# EasyEDA Pro project ProPrj_WatcheRobot2.0openSource_2026-06-17.epro, board 反馈舵机STM32控制板PCB
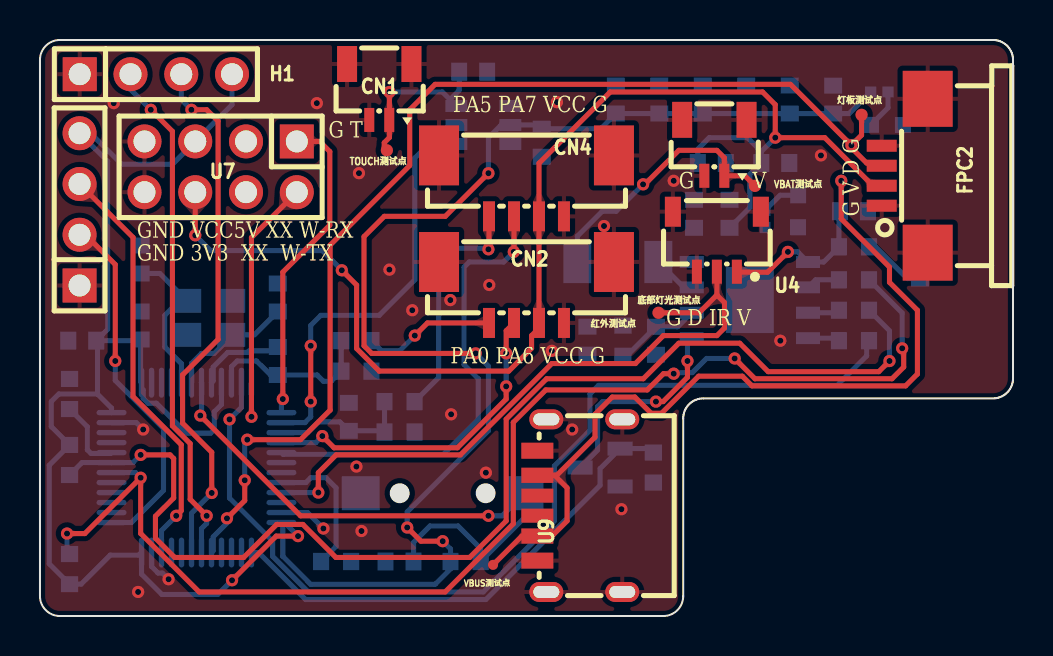
[diagram p10: board, top side]
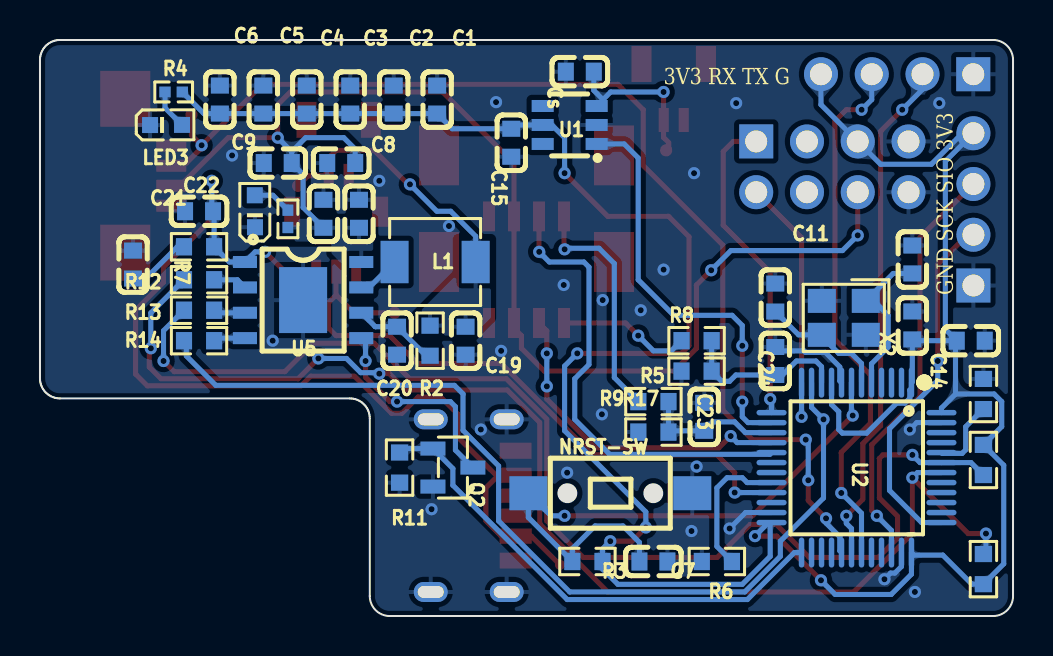
[diagram p11: board, bottom side, seen from below]

Outline 48.68 x 28.83 mm; copper layers: Top Layer, Bottom Layer. Coordinates in mm from the lower left corner of the outline.
Outline path: 0,27.83 0,1 arc(0.29,0.29) 1,0 31.18,0 arc(31.89,0.29) 32.18,1 32.18,9.89 32.19,9.98 32.2,10.07 32.22,10.16 32.25,10.25 32.29,10.34 32.33,10.42 32.39,10.49 32.44,10.56 32.51,10.63 32.58,10.69 32.66,10.74 32.74,10.78 32.82,10.82 32.91,10.85 33,10.87 33.09,10.89 33.18,10.89 47.68,10.89 47.78,10.89 47.87,10.91 47.96,10.93 48.04,10.96 48.13,10.99 48.21,11.04 48.29,11.09 48.36,11.15 48.42,11.22 48.48,11.29 48.53,11.36 48.58,11.44 48.62,11.53 48.64,11.62 48.67,11.71 48.68,11.8 48.68,11.89 48.68,27.83 48.68,27.92 48.67,28.01 48.64,28.1 48.62,28.19 48.58,28.27 48.53,28.35 48.48,28.43 48.42,28.5 48.36,28.57 48.29,28.62 48.21,28.68 48.13,28.72 48.04,28.76 47.96,28.79 47.87,28.81 47.78,28.82 47.68,28.83 1,28.83 arc(0.29,28.53) 0,27.83
Stack: Top Layer 0.035mm / Dielectric1 1.51mm FR4 er 4.5 / Bottom Layer 0.035mm

## Design rules (mm)
spacing copperThickness1oz (default): track to track 0.102, other pairs 0.152 to 0.3
spacing copperThickness2oz: track to track 0.203, other pairs 0.152 to 0.3
track width copperThickness1oz (default): min 0.127, default 0.254, max 2.54
track width copperThickness2oz: min 0.203, default 0.254, max 2.54
differential pair differentialPair (default): width min 0.127, default 0.254, max 2.54; gap min 0.152, default 0.152
net GND uses copperRegion

## Placement (name value [footprint] x y rotation side)
C1  100nF  [C0603]  28.81 25.84 270 bottom
C2  100nF  [C0603]  30.99 25.84 270 bottom
C3  100nF  [C0603]  33.16 25.84 270 bottom
C4  100nF  [C0603]  35.33 25.84 270 bottom
C5  100nF  [C0603]  37.51 25.84 270 bottom
C6  4.7uf  [C0603]  39.68 25.84 270 bottom
C7  100nF  [C0603]  17.99 2.73 180 bottom
C8  22uF  [C0603]  33.61 22.67 180 bottom
C9  22uF  [C0603]  36.79 22.67 180 bottom
C10  20pF  [C0603]  5.04 17.84 270 bottom
C11  20pF  [C0603]  11.9 15.94 270 bottom
C13  100nF  [C0603]  5.04 14.54 270 bottom
C14  100nF  [C0603]  2.12 13.78 0 bottom
C15  100nF  [C0603]  25.1 23.68 90 bottom
C17  22uF  [C0603]  32.72 20.13 270 bottom
C18  22uF  [C0603]  34.5 20.13 270 bottom
C19  22uF  [C0603]  27.39 13.78 90 bottom
C20  22uF  [C0603]  30.82 13.78 90 bottom
C21  10uF  [C0603]  44.03 17.59 270 bottom
C22  10uF  [C0603]  40.72 20.26 180 bottom
C23  100nF  [C0603]  15.45 9.97 270 bottom
C24  100nF  [C0603]  11.9 12.76 270 bottom
CN1  SH1.0mm立式  [CONN-SMD_2P-P1.00_HC-1.0-2PLT]  16.98 26.22 180 top
CN2  SH-MX1.25-4PLT  [CONN-SMD_4P-P1.25_SH-MX1.25-4PLT]  24.34 16.19 180 top
CN3  SH1.0mm立式  [CONN-SMD_2P-P1.00_HC-1.0-2PLT]  33.74 23.43 180 top
CN4  SH-MX1.25-4PLT  [CONN-SMD_4P-P1.25_SH-MX1.25-4PLT]  24.34 21.53 180 top
Cs  50pF  [C0603]  21.67 27.24 180 bottom
FPC2  FPC4_1mm(下接)  [FPC-SMD_4P-P1.00_C9900022405]  43.26 22.03 90 top
H1  PZ254V-11-04P  [HDR-TH_4P-P2.54-V-M]  5.8 27.11 0 top
H3  PZ254V-11-04P  [HDR-TH_4P-P2.54-V-M]  1.98 20.35 90 top
L1  1uH  [IND-SMD_L4.4-W4.2]  28.91 17.72 0 bottom
LED1  XL-1608UGC-04  [LED0603-RD_GREEN]  37.93 20.26 90 bottom
LED3  XL-1608UGC-04  [LED0603-RD_GREEN]  42.38 24.57 180 bottom
NOREF  -  [Pad_e447]  35.77 21.53 0 top
NOREF#2  -  [Pad_e448]  41.11 25.08 0 top
NOREF#3  -  [Pad_e446]  30.95 15.18 0 top
NOREF#4  -  [Pad_e445]  17.36 23.3 0 top
NRST-SW  1TS002C-2300-4300-CT  [SW-SMD_L6.0-W3.5-LS8.0-EH]  20.15 6.15 180 bottom
Q2  2N7002  [SOT-23-3_L2.9-W1.3-P1.90-LS2.4-BR]  28.02 7.43 0 bottom
R1  10K  [R0603]  1.48 11.11 270 bottom
R2  0Ω  [R0603]  29.17 13.78 90 bottom
R3  10K  [R0603]  21.29 2.73 0 bottom
R4  1kΩ  [R0402]  41.99 26.22 180 bottom
R5  18K  [R0603]  15.83 12.25 180 bottom
R6  10K  [R0603]  14.82 2.73 180 bottom
R7  2Ω  [R0603]  40.72 18.48 180 bottom
R8  10K  [R0603]  15.83 13.78 180 bottom
R9  10K  [R0603]  17.99 10.73 180 bottom
R10  10K  [R0603]  1.48 7.81 90 bottom
R11  100K  [R0603]  30.69 7.43 90 bottom
R12  0Ω  [R0603]  40.72 16.83 0 bottom
R13  0Ω  [R0603]  40.72 15.3 0 bottom
R14  0Ω  [R0603]  40.72 13.78 0 bottom
R15  1kΩ  [R0402]  36.28 19.87 270 bottom
R16  10K  [R0603]  1.48 2.35 270 bottom
R17  18K  [R0603]  17.99 9.21 0 bottom
U1  TTP223E-BA6  [SOT-23-6_L2.9-W1.6-P0.95-LS2.8-BR]  22.18 24.57 180 bottom
U2  STM32F103CBT6  [LQFP-48_L7.0-W7.0-P0.50-LS9.0-BL]  7.83 7.43 0 bottom
U4  ZX-SH1.0-3PLT  [CONN-SMD_3P-P1.00_HDGC_HDGC1002WV-S-3P]  33.87 18.73 180 top
U5  IP5306  [ESOP-8_L4.9-W3.9-P1.27-LS6.0-BL-EP]  35.52 15.81 270 bottom
U7  PZ2.54-2*4  [HDR-TH_8P-P2.54-V-M-R2-C4-S2.54]  9.04 22.48 180 top
U9  YTC-TC6-268  [TYPE-C-SMD_YIYUAN_YTC-TC6-268]  27.01 5.52 90 top
VBUS测试点  -  [Test-Point-0.5mm]  22.67 2.56 0 top
X2  8MHz  [CRYSTAL-SMD_4P-L3.2-W2.5-BL]  8.47 14.92 0 bottom

## Footprints (pads in the part's own frame, mm; a bottom-side part is the same pattern mirrored in y, then rotated)
C0603
  rect 0.8x0.9 smd: 1(-0.7,0) 2(0.7,0)
CONN-SMD_2P-P1.00_HC-1.0-2PLT
  rect 0.5x1.2 smd: 1(-0.5,1.4) 2(0.5,1.4)
  rect 1x1.8 smd: 3(1.61,-1.4) 4(-1.61,-1.4)
CONN-SMD_3P-P1.00_HDGC_HDGC1002WV-S-3P
  rect 0.5x1.2 smd: 1(-1,1.5) 2(0,1.5) 3(1,1.5)
  rect 0.8x1.5 smd: 4(2.2,-1.5) 5(-2.2,-1.5)
CONN-SMD_4P-P1.25_SH-MX1.25-4PLT
  rect 0.6x1.5 smd: 1(-1.875,1.525) 2(-0.625,1.525) 3(0.625,1.525) 4(1.875,1.525)
  rect 2x3 smd: 5(4.375,-1.525) 6(-4.375,-1.525)
CRYSTAL-SMD_4P-L3.2-W2.5-BL
  rect 1.4x1.2 smd: 1(-1.1,-0.85) 2(1.1,-0.85) 3(1.1,0.85) 4(-1.1,0.85)
ESOP-8_L4.9-W3.9-P1.27-LS6.0-BL-EP
  rect 0.6x1.2 smd: 1(-1.905,-2.909) 2(-0.635,-2.909) 3(0.635,-2.909) 4(1.905,-2.909) 5(1.905,2.909) 6(0.635,2.909) 7(-0.635,2.909) 8(-1.905,2.909)
  rect 3.3x2.4 smd: 9(0,0)
FPC-SMD_4P-P1.00_C9900022405
  rect 0.6x1.5 smd: 1(-1.5,1.15) 2(-0.5,1.15) 3(0.5,1.15) 4(1.5,1.15)
  rect 2.8x2.5 smd: 5(3.85,-1.15) 6(-3.85,-1.15)
HDR-TH_4P-P2.54-V-M
  rect 1.7x1.7 hole 1.1: 1(-3.81,0)
  round 1.7 hole 1.1: 2(-1.27,0) 3(1.27,0) 4(3.81,0)
HDR-TH_8P-P2.54-V-M-R2-C4-S2.54
  rect 1.7x1.7 hole 1.1: 1(-3.81,-1.27)
  round 1.7 hole 1.1: 2(-3.81,1.27) 3(-1.27,-1.27) 4(-1.27,1.27) 5(1.27,-1.27) 6(1.27,1.27) 7(3.81,-1.27) 8(3.81,1.27)
IND-SMD_L4.4-W4.2
  rect 1.4x2.12 smd: 1(2.028,0) 2(-2.028,0)
LED0603-RD_GREEN
  rect 0.8x0.8 smd: 1(-0.799,-0.004) 2(0.799,0.004)
LQFP-48_L7.0-W7.0-P0.50-LS9.0-BL
  oval 0.27x1.5 smd: 1(-2.75,-4.25) 2(-2.25,-4.25) 3(-1.75,-4.25) 4(-1.25,-4.25) 5(-0.75,-4.25) 6(-0.25,-4.25) 7(0.25,-4.25) 8(0.75,-4.25) 9(1.25,-4.25) 10(1.75,-4.25) 11(2.25,-4.25) 12(2.75,-4.25) 25(2.75,4.25) 26(2.25,4.25) 27(1.75,4.25) 28(1.25,4.25) 29(0.75,4.25) 30(0.25,4.25) 31(-0.25,4.25) 32(-0.75,4.25) 33(-1.25,4.25) 34(-1.75,4.25) 35(-2.25,4.25) 36(-2.75,4.25)
  oval 1.5x0.27 smd: 13(4.25,-2.75) 14(4.25,-2.25) 15(4.25,-1.75) 16(4.25,-1.25) 17(4.25,-0.75) 18(4.25,-0.25) 19(4.25,0.25) 20(4.25,0.75) 21(4.25,1.25) 22(4.25,1.75) 23(4.25,2.25) 24(4.25,2.75) 37(-4.25,2.75) 38(-4.25,2.25) 39(-4.25,1.75) 40(-4.25,1.25) 41(-4.25,0.75) 42(-4.25,0.25) 43(-4.25,-0.25) 44(-4.25,-0.75) 45(-4.25,-1.25) 46(-4.25,-1.75) 47(-4.25,-2.25) 48(-4.25,-2.75)
Pad_e445
  round 0.61 smd: TP1(0,0)
Pad_e446
  round 0.61 smd: TP3(0,0)
Pad_e447
  round 0.61 smd: TP2(0,0)
Pad_e448
  round 0.61 smd: TP5(0,0)
R0402
  rect 0.566x0.54 smd: 1(-0.433,0) 2(0.433,0)
R0603
  rect 0.806x0.864 smd: 1(-0.753,0) 2(0.753,0)
SOT-23-3_L2.9-W1.3-P1.90-LS2.4-BR
  rect 1.25x0.7 smd: 1(1,-0.95) 2(1,0.95) 3(-1,0)
SOT-23-6_L2.9-W1.6-P0.95-LS2.8-BR
  rect 1.1x0.6 smd: 1(1.35,-0.95) 2(1.35,0) 3(1.35,0.95) 4(-1.35,0.95) 5(-1.35,0) 6(-1.35,-0.95)
SW-SMD_L6.0-W3.5-LS8.0-EH
  rect 1.9x1.7 smd: 1(-4.1,0) 2(4.1,0)
Test-Point-0.5mm
  round 0.5 smd: 1(0,0)
TYPE-C-SMD_YIYUAN_YTC-TC6-268
  oval 1x1.7 hole 0.6x1.3: 1(-4.32,1.675) 2(4.32,1.675) 3(4.32,-2.124) 4(-4.32,-2.124)
  rect 0.7x1.6 smd: A5(-0.5,2.124) B5(0.5,2.124)
  rect 0.76x1.6 smd: A9(1.52,2.124) B9(-1.52,2.124)
  rect 0.8x1.6 smd: A12(2.75,2.124) B12(-2.75,2.124)

## Nets
As in the schematic, except:
VBAT: C19.2 CN3.1 L1.2 NOREF.TP2 R2.2
LED_DI: FPC2.3 NOREF#2.TP5 U2.29
WS2812_BOTTOM_DIN: NOREF#3.TP3 U2.21 U4.2
$1N85: CN1.1 Cs.2 NOREF#4.TP1 U1.3

Pads without a net: U1 4 6; U2 2 3 4 18 19 22 26 27 28 32 33 38 39 40 41 45 46; U9 A5 B5

## Via types
v1: diameter 0.61, hole 0.305, Top Layer to Bottom Layer, 69 vias

## Routing (per net, layer and track width the routed paths; a pad name or vN(x,y) marks a point on that pad's centre or on a via; arc(x,y) is an arc through that point)
GND: length 10.5
  Bottom Layer w0.254: NRST-SW.2 16.09,6.11 ; C24.1 11.7,13.27 10.46,13.27 10.38,13.19 9.39,13.19 8.67,12.46 8.67,11.76 U2.8 ; U2.23 13.38,5.18 v1(14.18,4.38) ; v1(5.16,9.33) 4.82,9.68 U2.47 ; U2.35 5.58,2.48 5.91,2.15 6.13,2.15 v1(6.43,1.84)
  vias: v1(3.69,25.67) v1(4.91,1.21) v1(13.85,25.67) v1(15.83,7.48) v1(15.96,22.16) v1(16.09,4.25) v1(17.48,17.33) v1(18.63,15.3) v1(20.53,15.81) v1(20.57,10.1) v1(22.31,7.17) v1(22.48,16.57) v1(25.61,13.27) v1(25.87,25.72) v1(26.63,9.33) v1(28.22,19.52) v1(29.09,5.35) v1(31.71,21.78) v1(37.04,13.78) v1(39.07,23.05)
VBAT: length 13.2
  Top Layer w0.254: NOREF.TP2 35.27,22.03 CN3.1 34.24,22.93 33.87,23.3 31.96,23.3 30.26,21.6 v1(30.17,21.6)
  Bottom Layer w0.254: L1.2 26.89,19.01 28.13,20.26 28.83,20.26 v1(30.17,21.6)
VBUS: length 50.8
  Top Layer w0.254: 25.74,7.04 25.86,7.04 27.77,8.95 27.77,10.1 28.63,10.96 29.76,10.96 30.58,10.15 31.1,10.15 32.95,12 35.14,12 35.62,11.52 43.31,11.52 43.9,12.11 43.9,15.3 42.5,16.7 42.5,17.46 40.09,19.87 v1(40.09,21.78) ; 25.74,7.04 26.37,6.41 26.37,4.76 25.62,4 U9.B9 24.11,4 VBUS测试点.1 ; 25.74,7.04 U9.A9 ; v1(37.42,18.22) 36.41,17.21 34.89,17.21 34.76,17.08
  Bottom Layer w0.254: v1(37.42,18.22) 37.92,18.22 U5.1 39.21,17.72 R7.2 39.97,20.2 C22.2 40.09,20.32 v1(40.09,21.78)
VCC_5V: length 64.9
  Top Layer w0.254: U7.6 v1(7.77,19.05) ; v1(15.1,17.3) 15.84,16.56 15.84,13.39 16.97,12.26 23.45,12.26 24.6,13.4 24.6,14.03 24.97,14.4 CN2.2 24.97,22.66 28.53,26.22 36.15,26.22 36.79,25.59 v1(36.79,23.94) 39.27,23.94 41.67,21.53 FPC2.2
  Bottom Layer w0.254: v1(36.79,23.94) 36.09,23.24 ; 36.09,23.24 C9.2 35.52,22.1 35.52,20.44 C18.2 ; 36.09,23.24 36.09,23.24 35.39,23.94 33.49,23.94 32.91,23.37 C8.2 ; v1(7.77,19.05) 8.53,18.29 14.12,18.29 v1(15.1,17.3)
BOOT0: length 3.7
  Bottom Layer w0.254: U2.44 3.54,8.14 2.55,8.14 2.37,8.32 2.37,9.47 R1.2
LED_DI: length 55.5
  Top Layer w0.254: v1(10.37,8.83) 13.04,8.83 14.52,10.3 14.52,18.56 18.5,22.54 18.5,25.34 19.77,26.61 37.55,26.61 v1(40.6,23.56) ; v1(10.24,6.79) 10.24,5.78 v1(9.36,4.89) ; FPC2.3 41.98,22.67 41.36,22.67 40.6,23.43 v1(40.6,23.56) ; v1(40.6,23.56) 41.11,24.07 NOREF#2.TP5
  Bottom Layer w0.254: v1(10.24,6.79) 10.24,8.7 v1(10.37,8.83) ; U2.29 8.67,3.26 8.67,3.96 9.36,4.65 v1(9.36,4.89)
NRST: length 30.5
  Top Layer w0.254: v1(22.44,5.02) 13.04,5.02 v1(8.02,10.03)
  Bottom Layer w0.254: v1(8.02,10.03) 8.09,10.1 8.09,11.67 U2.7 ; v1(22.44,5.02) 23.12,5.02 NRST-SW.1 24.25,4.93 R3.2 22.05,3.37 20.91,4.51 19.52,4.51 18.69,3.68 C7.1
OSC_IN: length 8
  Bottom Layer w0.254: U2.5 7.08,12.62 6.24,13.46 6.24,15.05 6.97,15.77 X2.1 6,17.14 C10.2
OSC_OUT: length 6.4
  Bottom Layer w0.254: U2.6 7.58,12.64 8.09,13.14 8.72,13.14 9.57,13.99 X2.3 10.73,14.07 C11.2
PA0/SERVO1FB: length 6.7
  Top Layer w0.254: CN2.4 19.39,14.67 v1(18.75,14.03)
  Bottom Layer w0.254: v1(18.75,14.03) 17.99,13.27 17.09,13.27 R8.1
PA1_IP5306_IRQ: length 48.7
  Bottom Layer w0.254: R14.2 41.36,13.66 41.36,13.02 39.89,11.54 27.95,11.54 27.52,11.11 27.52,9.29 25.74,7.51 25.74,4.76 22.18,1.21 13.42,1.21 11.64,2.99 11.64,3.75 9.48,5.9 v1(9.48,9.84) 10.08,10.44 U2.11
PA5/SERVO2FB: length 11.9
  Top Layer w0.254: v1(22.44,18.35) 22.47,18.38 22.47,20
  Bottom Layer w0.254: R9.1 19.95,11.93 19.95,17.64 20.71,18.4 22.38,18.4 v1(22.44,18.35)
PA6TIME3: length 16.6
  Top Layer w0.254: v1(23.33,11.49) 23.33,10.86 20.89,8.42 14.71,8.42 v1(14.13,9.01) ; v1(23.33,13.14) 23.33,14.28 CN2.3
  Bottom Layer w0.254: U2.16 13.8,8.68 v1(14.13,9.01) ; v1(23.33,11.49) v1(23.33,13.14)
PA7TIME3: length 23.1
  Top Layer w0.254: 23.72,20 23.72,18.23 v1(23.71,18.22)
  Bottom Layer w0.254: U2.17 12.17,8.09 20.18,8.09 21.93,9.84 21.93,11.87 21.22,12.58 21.22,17.46 21.47,17.72 23.2,17.72 v1(23.71,18.22)
PA9/USART1_TX: length 25.6
  Top Layer w0.254: v1(8.34,5.02) 7.52,5.84 7.52,8.63 6.63,9.52 6.63,24.25 v1(5.55,25.34)
  Bottom Layer w0.254: U2.30 8.08,4.38 8.34,4.63 v1(8.34,5.02) ; H1.2 4.53,26.35 v1(5.55,25.34)
PA10/USART1_RX: length 26.9
  Top Layer w0.254: v1(8.59,6.16) 8.59,8.19 7.13,9.65 7.13,12.07 8.91,13.84 8.91,24.77 8.34,25.34 v1(7.58,25.34)
  Bottom Layer w0.254: v1(7.58,25.34) 7.07,25.84 H1.3 ; U2.31 7.58,5.15 v1(8.59,6.16)
PA13/SWDIO: length 21
  Top Layer w0.254: H3.3 4.66,18.95 4.66,10.98 7.07,8.57 7.07,5.27 v1(6.82,5.02)
  Bottom Layer w0.254: U2.34 6.08,4.28 v1(6.82,5.02)
PA14/SWCLK: length 18
  Top Layer w0.254: v1(3.77,12.76) 3.77,17.59 2.28,19.08 H3.2
  Bottom Layer w0.254: v1(3.77,12.76) 3.77,11.79 6.18,9.38 6.18,6.29 4.57,4.68 U2.37
PB2(BOOT1): length 7
  Bottom Layer w0.254: U2.20 13.3,6.68 13.55,6.92 14.31,6.92 14.82,6.41 14.82,3.48 R6.2
PB6/SCL: length 63.2
  Top Layer w0.254: v1(1.35,4.13) 2.24,4.13 v1(5.04,6.92) 5.04,4.13 7.96,1.21 20.27,1.21 23.68,4.61 23.68,9.69 25.31,11.31 30.38,11.31 31.2,12.13 v1(31.71,12.13) ; v1(34.76,12.89) 35.77,11.87 42.63,11.87 43.21,12.46 43.21,13.32 v1(43.14,13.4)
  Bottom Layer w0.254: R16.1 1.35,3.23 v1(1.35,4.13) ; v1(34.76,12.89) 33.35,12.89 32.64,12.18 31.76,12.18 v1(31.71,12.13) ; v1(43.14,13.4) 43.14,15.17 R12.2 ; U2.42 4.78,7.18 v1(5.04,6.92)
PB7/SDA: length 59.8
  Top Layer w0.254: v1(42.5,12.76) 41.97,12.23 36.43,12.23 35.01,13.65 31.96,13.65 30.18,11.87 25.35,11.87 23.33,9.85 23.33,4.76 21.49,2.93 14.81,2.93 13.15,4.58 11.84,4.58 10.19,2.93 6.74,2.93 5.78,3.89 5.78,4.99 6.69,5.9 6.69,7.88 6.51,8.06 v1(5.04,8.06)
  Bottom Layer w0.254: R13.2 42.5,14.28 v1(42.5,12.76) ; v1(5.04,8.06) 4.65,7.68 U2.43 2.1,7.68 1.48,7.06
PB12_IP5306_KEY: length 24.8
  Bottom Layer w0.254: U2.25 10.94,3.18 13.29,0.82 22.3,0.82 28.02,6.54 28.02,7.38 Q2.1 30.49,8.38 R11.2
TOUCH: length 20.8
  Top Layer w0.254: v1(13.55,10.73) v1(13.55,13.52)
  Bottom Layer w0.254: U2.14 13.26,9.68 13.55,9.97 v1(13.55,10.73) ; v1(13.55,13.52) 13.55,14.54 14.05,15.05 16.98,15.05 18.75,16.83 18.75,22.92 19.45,23.62 U1.1
WATCHER_3V3: length 133
  Top Layer w0.254: v1(9.61,1.79) 11.82,4 v1(12.91,4) ; v1(21.8,13.14) 16.59,13.14 16.21,13.52 16.21,18.99 17.23,20 20.28,20 v1(22.44,22.16) ; v1(18.37,4.43) 19.06,3.75 v1(20.15,3.75)
  Bottom Layer w0.254: C14.2 3.39,14.35 3.39,22.76 H3.4 2.53,24.16 4.09,22.61 6.63,22.61 U7.5 9.61,25.59 H1.4 ; C14.2 2.88,13.72 2.88,11.11 2.87,11.11 ; C14.2 4.98,13.78 C13.2 5.04,11.72 U2.1 5.08,11.4 5.17,11.31 5.17,10.89 5.41,10.65 5.83,10.65 7.32,9.15 8.54,9.15 8.72,9.33 8.72,10.22 9.08,10.58 U2.9 ; R4.2 40.48,25.14 C6.2 C5.2 C4.2 C3.2 C2.2 C1.2 28.05,24.38 C15.2 24.91,24.57 U1.5 23.07,24.57 22.44,23.94 v1(22.44,22.16) ; v1(12.91,4) 12.23,4.68 U2.24 12.15,4.61 12.15,2.98 13.55,1.59 19.77,1.59 20.54,2.36 R3.1 20.54,3.36 v1(20.15,3.75) ; 2.87,11.11 3.58,10.41 U2.48 ; 2.87,11.11 2.86,11.12 ; 2.87,11.11 0.95,11.11 0.57,10.73 0.57,9.48 R10.2 0.47,7.55 0.47,2.61 R16.2 2.06,1.6 3.51,3.05 4.95,3.05 U2.36 5.08,2.09 6.1,1.08 8.9,1.08 v1(9.61,1.79) ; v1(21.8,13.14) 22.44,12.51 22.44,9.27 18.37,5.21 v1(18.37,4.43)
WATCHER_RX: length 13.9
  Top Layer w0.254: U7.2 10.58,18.94 v1(10.58,9.97)
  Bottom Layer w0.254: U2.12 v1(10.58,9.97)
WATCHER_TX: length 15.9
  Top Layer w0.254: v1(12.15,10.86) 12.15,17.21 14.5,19.56 14.5,23.24 13.99,23.75 U7.1
  Bottom Layer w0.254: U2.13 12.08,10.79 v1(12.15,10.86)
WS2812_BOTTOM_DIN: length 32.7
  Top Layer w0.254: NOREF#3.TP3 32.98,15.18 33.83,16.03 ; 33.83,16.03 33.9,16.03 34.25,15.68 34.25,14.41 33.87,14.03 31.19,14.03 29.79,12.64 25.61,12.64 21.04,8.06 14.82,8.06 13.93,7.17 v1(13.93,6.18) ; 33.83,16.03 33.87,16.07 33.87,17.49
  Bottom Layer w0.254: U2.21 v1(13.93,6.18)
$1N35: length 7.1
  Bottom Layer w0.254: U2.15 13.39,9.18 13.93,9.71 15.01,9.71 C23.2 17.18,9.27 17.24,9.21 17.24,10.73
$1N37: length 8.6
  Bottom Layer w0.254: R8.2 R5.2 14.57,11.75 14.18,11.75 13.87,12.06 C24.2 11.54,12.06 10.84,12.76 9.86,12.76 9.58,12.48 U2.10
$1N45: length 1.6
  Bottom Layer w0.254: U5.4 39.84,13.91 R14.1
$1N46: length 1.6
  Bottom Layer w0.254: U5.3 39.84,15.18 R13.1
$1N47: length 1.7
  Bottom Layer w0.254: R12.1 38.81,16.83 U5.2
$1N54: length 10.6
  Top Layer w0.254: v1(32.39,12.76) 32.39,11.95 31.18,10.73 v1(30.82,10.73)
  Bottom Layer w0.254: U5.5 32.39,13.69 v1(32.39,12.76) ; v1(30.82,10.73) 28.15,10.73 27.9,10.48 27.9,8.3 Q2.3
$1N57: length 2
  Bottom Layer w0.254: LED1.2 37.03,21.05 R15.1
$1N58: length 2
  Bottom Layer w0.254: R4.1 42.43,25.43 LED3.2
$1N85: length 8.3
  Top Layer w0.254: 17.48,24.82 17.48,24.83 v1(17.48,26.22) ; NOREF#4.TP1 17.23,23.43 17.23,23.69 17.48,23.95 17.48,24.82 17.48,24.82
  Bottom Layer w0.254: Cs.2 20.97,26.31 20.51,25.84 ; 20.51,25.84 20.13,26.22 v1(17.48,26.22) ; 20.51,25.84 U1.3
$1N117: length 3.2
  Bottom Layer w0.254: C21.2 43.39,16.89 41.8,18.48 R7.1
$1N124: length 4.3
  Bottom Layer w0.254: U5.6 31.92,14.48 31.89,14.48 31.89,14.48 C20.2 29.36,13.03 R2.1
$1N129: length 2.2
  Bottom Layer w0.254: L1.1 32.21,16.45 U5.7

## Copper pours and planes (outline as drawn; the poured copper is in the pictures)
GND on Top Layer: -2.52,30.86 50.82,30.86 50.82,-2.29 -2.52,-2.29
GND on Bottom Layer: -1.37,30.48 49.93,30.48 49.93,-5.97 -1.37,-5.97
VBAT on Bottom Layer: 26.12,18.86 27.77,18.86 27.77,17.15 29.83,15.09 29.83,14.1 29.76,14.03 27.01,14.03 26.12,14.92
VCC_5V on Bottom Layer: 32.01,17.38 32.01,19.87 36.91,19.87 36.91,18.87 36.79,18.74 34.1,18.74 34.1,18.15 33.34,17.38

Small or netless copper shapes (teardrops, artwork), in the pictures only: 103 on Top Layer, 210 on Bottom Layer

## Text on the board
Bottom Silkscreen Layer: 3V3 RX TX G | GND SCK SIO 3V3
Top Silkscreen Layer: TOUCH测试点 | 红外测试点 | 底部灯光测试点 | VBAT测试点 | 灯板测试点 | GND VCC5V XX W-RX | GND 3V3  XX  W-TX | G T | PA0 PA6 VCC G | PA5 PA7 VCC G | G D IR V | G | V | G V D G
